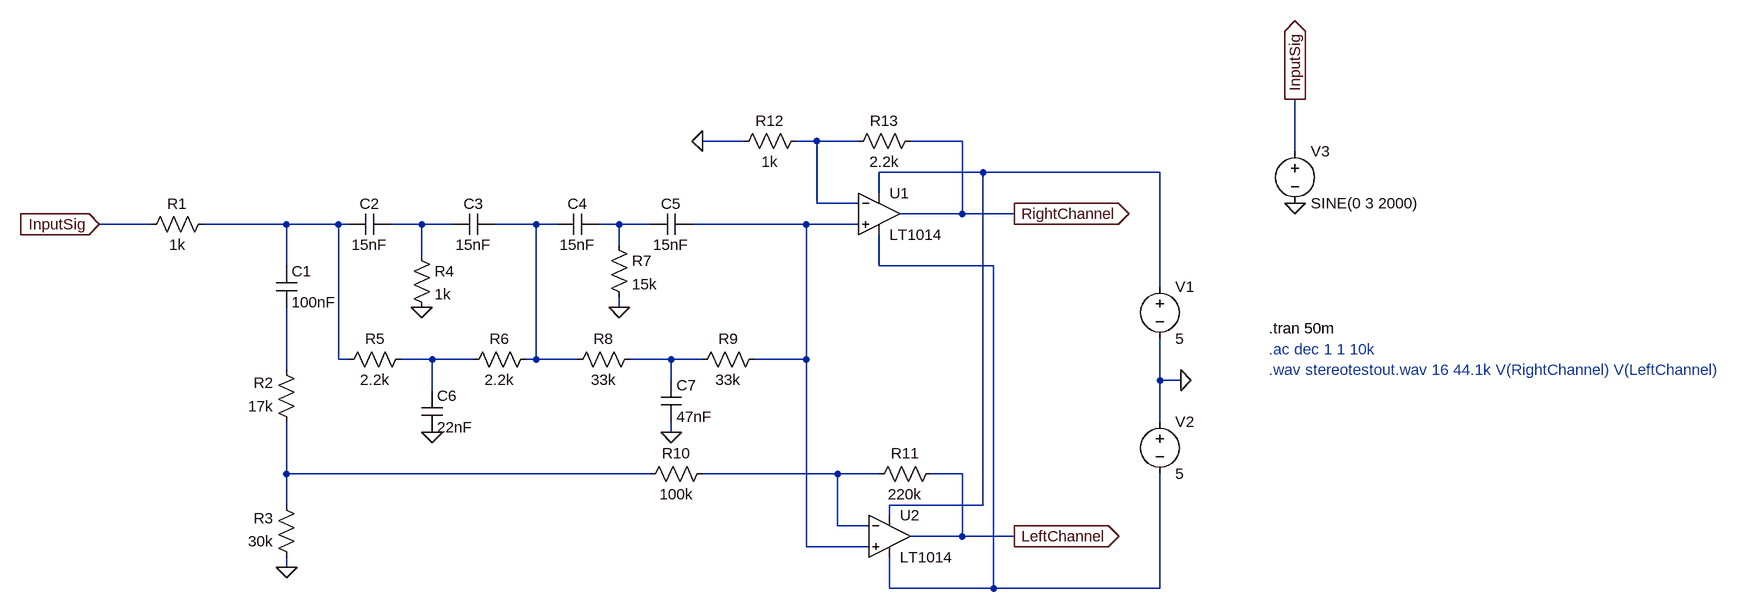
[diagram p0: schematic Stereo Modulation Effects .asc]
Stereo Modulation Effects .asc, the LTspice schematic file:
Version 4
SHEET 1 2464 744
WIRE 944 48 880 48
WIRE 1056 48 1024 48
WIRE 1120 48 1056 48
WIRE 1280 48 1200 48
WIRE 1792 64 1792 -16
WIRE 1312 96 1152 96
WIRE 1584 96 1312 96
WIRE 1152 128 1152 96
WIRE 1056 144 1056 48
WIRE 1120 144 1056 144
WIRE 1280 160 1280 48
WIRE 1280 160 1184 160
WIRE 1360 160 1280 160
WIRE 32 176 -48 176
WIRE 240 176 112 176
WIRE 320 176 240 176
WIRE 336 176 320 176
WIRE 448 176 400 176
WIRE 496 176 448 176
WIRE 624 176 560 176
WIRE 656 176 624 176
WIRE 752 176 720 176
WIRE 800 176 752 176
WIRE 1040 176 864 176
WIRE 1120 176 1040 176
WIRE 752 208 752 176
WIRE 448 224 448 176
WIRE 240 240 240 176
WIRE 1152 240 1152 192
WIRE 1328 240 1152 240
WIRE 1584 272 1584 96
WIRE 752 304 752 288
WIRE 320 384 320 176
WIRE 336 384 320 384
WIRE 464 384 416 384
WIRE 528 384 464 384
WIRE 624 384 624 176
WIRE 624 384 608 384
WIRE 688 384 624 384
WIRE 832 384 768 384
WIRE 880 384 832 384
WIRE 1040 384 1040 176
WIRE 1040 384 960 384
WIRE 240 400 240 304
WIRE 832 416 832 384
WIRE 1584 416 1584 352
WIRE 1616 416 1584 416
WIRE 464 432 464 384
WIRE 1584 480 1584 416
WIRE 832 496 832 480
WIRE 240 560 240 480
WIRE 800 560 240 560
WIRE 1088 560 880 560
WIRE 1152 560 1088 560
WIRE 1280 560 1232 560
WIRE 240 608 240 560
WIRE 1312 608 1312 96
WIRE 1312 608 1168 608
WIRE 1168 624 1168 608
WIRE 1088 640 1088 560
WIRE 1136 640 1088 640
WIRE 1280 656 1280 560
WIRE 1280 656 1200 656
WIRE 1360 656 1280 656
WIRE 1040 672 1040 384
WIRE 1136 672 1040 672
WIRE 240 704 240 688
WIRE 1168 736 1168 688
WIRE 1328 736 1328 240
WIRE 1328 736 1168 736
WIRE 1584 736 1584 560
WIRE 1584 736 1328 736
FLAG 240 704 0
FLAG 448 304 0
FLAG 464 496 0
FLAG 752 304 0
FLAG 832 496 0
FLAG 880 48 0
FLAG 1616 416 0
FLAG 1360 160 RightChannel
IOPIN 1360 160 Out
FLAG 1360 656 LeftChannel
IOPIN 1360 656 Out
FLAG -48 176 InputSig
IOPIN -48 176 In
FLAG 1792 144 0
FLAG 1792 -16 InputSig
IOPIN 1792 -16 Out
SYMBOL res 128 160 R90
WINDOW 0 0 56 VBottom 2
WINDOW 3 32 56 VTop 2
SYMATTR InstName R1
SYMATTR Value 1k
SYMBOL res 256 496 R180
WINDOW 0 36 76 Left 2
WINDOW 3 36 40 Left 2
SYMATTR InstName R2
SYMATTR Value 17k
SYMBOL res 256 704 R180
WINDOW 0 36 76 Left 2
WINDOW 3 36 40 Left 2
SYMATTR InstName R3
SYMATTR Value 30k
SYMBOL cap 224 240 R0
SYMATTR InstName C1
SYMATTR Value 100nF
SYMBOL cap 400 160 R90
WINDOW 0 0 32 VBottom 2
WINDOW 3 32 32 VTop 2
SYMATTR InstName C2
SYMATTR Value 15nF
SYMBOL cap 560 160 R90
WINDOW 0 0 32 VBottom 2
WINDOW 3 32 32 VTop 2
SYMATTR InstName C3
SYMATTR Value 15nF
SYMBOL cap 720 160 R90
WINDOW 0 0 32 VBottom 2
WINDOW 3 32 32 VTop 2
SYMATTR InstName C4
SYMATTR Value 15nF
SYMBOL cap 864 160 R90
WINDOW 0 0 32 VBottom 2
WINDOW 3 32 32 VTop 2
SYMATTR InstName C5
SYMATTR Value 15nF
SYMBOL res 432 208 R0
SYMATTR InstName R4
SYMATTR Value 1k
SYMBOL res 432 368 R90
WINDOW 0 0 56 VBottom 2
WINDOW 3 32 56 VTop 2
SYMATTR InstName R5
SYMATTR Value 2.2k
SYMBOL res 624 368 R90
WINDOW 0 0 56 VBottom 2
WINDOW 3 32 56 VTop 2
SYMATTR InstName R6
SYMATTR Value 2.2k
SYMBOL cap 448 432 R0
SYMATTR InstName C6
SYMATTR Value 22nF
SYMBOL res 736 192 R0
SYMATTR InstName R7
SYMATTR Value 15k
SYMBOL res 784 368 R90
WINDOW 0 0 56 VBottom 2
WINDOW 3 32 56 VTop 2
SYMATTR InstName R8
SYMATTR Value 33k
SYMBOL res 976 368 R90
WINDOW 0 0 56 VBottom 2
WINDOW 3 32 56 VTop 2
SYMATTR InstName R9
SYMATTR Value 33k
SYMBOL cap 816 416 R0
SYMATTR InstName C7
SYMATTR Value 47nF
SYMBOL Opamps/LT1014 1152 96 R0
SYMATTR InstName U1
SYMBOL Opamps/LT1014 1168 592 R0
SYMATTR InstName U2
SYMBOL res 1248 544 R90
WINDOW 0 0 56 VBottom 2
WINDOW 3 32 56 VTop 2
SYMATTR InstName R11
SYMATTR Value 220k
SYMBOL res 896 544 R90
WINDOW 0 0 56 VBottom 2
WINDOW 3 32 56 VTop 2
SYMATTR InstName R10
SYMATTR Value 100k
SYMBOL res 1040 32 R90
WINDOW 0 0 56 VBottom 2
WINDOW 3 32 56 VTop 2
SYMATTR InstName R12
SYMATTR Value 1k
SYMBOL res 1216 32 R90
WINDOW 0 0 56 VBottom 2
WINDOW 3 32 56 VTop 2
SYMATTR InstName R13
SYMATTR Value 2.2k
SYMBOL voltage 1584 256 R0
SYMATTR InstName V1
SYMATTR Value 5
SYMBOL voltage 1584 464 R0
SYMATTR InstName V2
SYMATTR Value 5
SYMBOL voltage 1792 48 R0
SYMATTR InstName V3
SYMATTR Value SINE(0 3 2000)
SYMATTR Value2 AC 1
TEXT 1752 368 Left 2 ;.ac dec 1 1 10k
TEXT 1752 336 Left 2 !.tran 50m
TEXT 1752 400 Left 2 ;.wav stereotestout.wav 16 44.1k V(RightChannel) V(LeftChannel)

The netlist it stands for:
* Stereo Modulation Effects .asc
R1 N003 InputSig 1k
R2 N012 N011 17k
R3 0 N012 30k
C1 N003 N011 100nF
C2 N004 N003 15nF
C3 N005 N004 15nF
C4 N006 N005 15nF
C5 N007 N006 15nF
R4 N004 0 1k
R5 N009 N003 2.2k
R6 N005 N009 2.2k
C6 N009 0 22nF
R7 N006 0 15k
R8 N010 N005 33k
R9 N007 N010 33k
C7 N010 0 47nF
XU1 N007 N001 N002 N008 RightChannel LT1014  ; pins In+ In- V+ V- OUT
XU2 N007 N013 N002 N008 LeftChannel LT1014  ; pins In+ In- V+ V- OUT
R11 LeftChannel N013 220k
R10 N013 N012 100k
R12 N001 0 1k
R13 RightChannel N001 2.2k
V1 N002 0 5
V2 0 N008 5
V3 InputSig 0 SINE(0 3 2000) AC 1
* .ac dec 1 1 10k
.tran 50m
* .wav stereotestout.wav 16 44.1k V(RightChannel) V(LeftChannel)
.backanno
.end